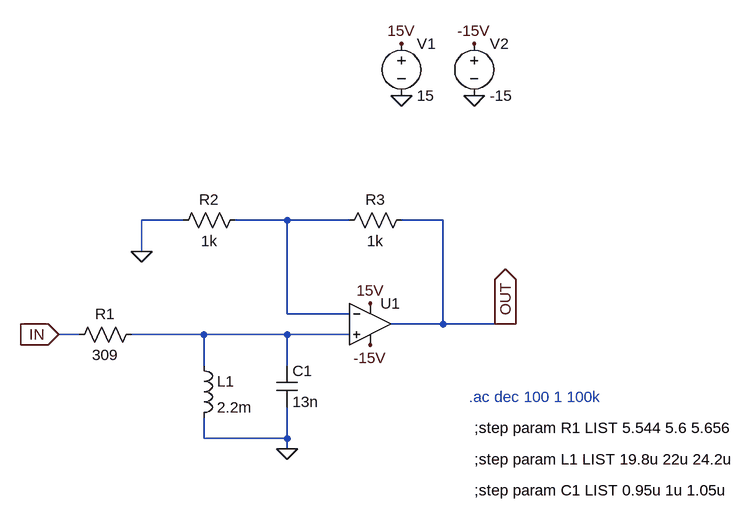
[diagram p0: schematic AFE_bandpass_v3.asc]
AFE_bandpass_v3.asc, the LTspice schematic file:
Version 4
SHEET 1 1364 680
WIRE 432 -64 368 -64
WIRE 592 -64 512 -64
WIRE 688 -64 592 -64
WIRE 832 -64 768 -64
WIRE 368 -16 368 -64
WIRE 592 80 592 -64
WIRE 688 80 592 80
WIRE 832 96 832 -64
WIRE 832 96 752 96
WIRE 928 96 832 96
WIRE 944 96 928 96
WIRE 272 112 240 112
WIRE 464 112 352 112
WIRE 592 112 464 112
WIRE 688 112 592 112
WIRE 464 160 464 112
WIRE 592 160 592 112
WIRE 464 272 464 240
WIRE 592 272 592 224
WIRE 592 272 464 272
WIRE 592 288 592 272
FLAG 592 288 0
FLAG 368 -16 0
FLAG 768 -256 0
FLAG 880 -256 0
FLAG 720 64 15V
FLAG 768 -336 15V
FLAG 880 -336 -15V
FLAG 720 128 -15V
FLAG 928 96 OUT
IOPIN 928 96 Out
FLAG 240 112 IN
IOPIN 240 112 In
SYMBOL res 368 96 R90
WINDOW 0 0 56 VBottom 2
WINDOW 3 32 56 VTop 2
SYMATTR InstName R1
SYMATTR Value 309
SYMBOL res 528 -80 R90
WINDOW 0 0 56 VBottom 2
WINDOW 3 32 56 VTop 2
SYMATTR InstName R2
SYMATTR Value 1k
SYMBOL res 784 -80 R90
WINDOW 0 0 56 VBottom 2
WINDOW 3 32 56 VTop 2
SYMATTR InstName R3
SYMATTR Value 1k
SYMBOL ind 448 144 R0
SYMATTR InstName L1
SYMATTR Value 2.2m
SYMBOL cap 576 160 R0
SYMATTR InstName C1
SYMATTR Value 13n
SYMBOL OpAmps\\UniversalOpAmp2 720 96 R0
SYMATTR InstName U1
SYMATTR Value2 Avol=1Meg GBW=5Meg Slew=12Meg Vos=3m
SYMBOL voltage 768 -352 R0
WINDOW 123 0 0 Left 0
WINDOW 39 0 0 Left 0
SYMATTR InstName V1
SYMATTR Value 15
SYMBOL voltage 880 -352 R0
WINDOW 123 0 0 Left 0
WINDOW 39 0 0 Left 0
SYMATTR InstName V2
SYMATTR Value -15
TEXT 872 208 Left 2 ;.ac dec 100 1 100k
TEXT 880 256 Left 2 !;step param R1 LIST 5.544 5.6 5.656
TEXT 880 304 Left 2 !;step param L1 LIST 19.8u 22u 24.2u
TEXT 880 352 Left 2 !;step param C1 LIST 0.95u 1u 1.05u

The netlist it stands for:
* AFE_bandpass_v3.asc
R1 N002 IN 309
R2 N001 0 1k
R3 OUT N001 1k
L1 N002 0 2.2m
C1 N002 0 13n
XU1 N002 N001 15V -15V OUT level2 Avol=1Meg GBW=5Meg Slew=12Meg Vos=3m Ilimit=25m Rail=0 Vos=0 En=0 Enk=0 In=0 Ink=0 Rin=500Meg  ; pins In+ In- V+ V- OUT
V1 15V 0 15
V2 -15V 0 -15
* .ac dec 100 1 100k
;step param R1 LIST 5.544 5.6 5.656
;step param L1 LIST 19.8u 22u 24.2u
;step param C1 LIST 0.95u 1u 1.05u
.lib UniversalOpAmp2.lib
.backanno
.end